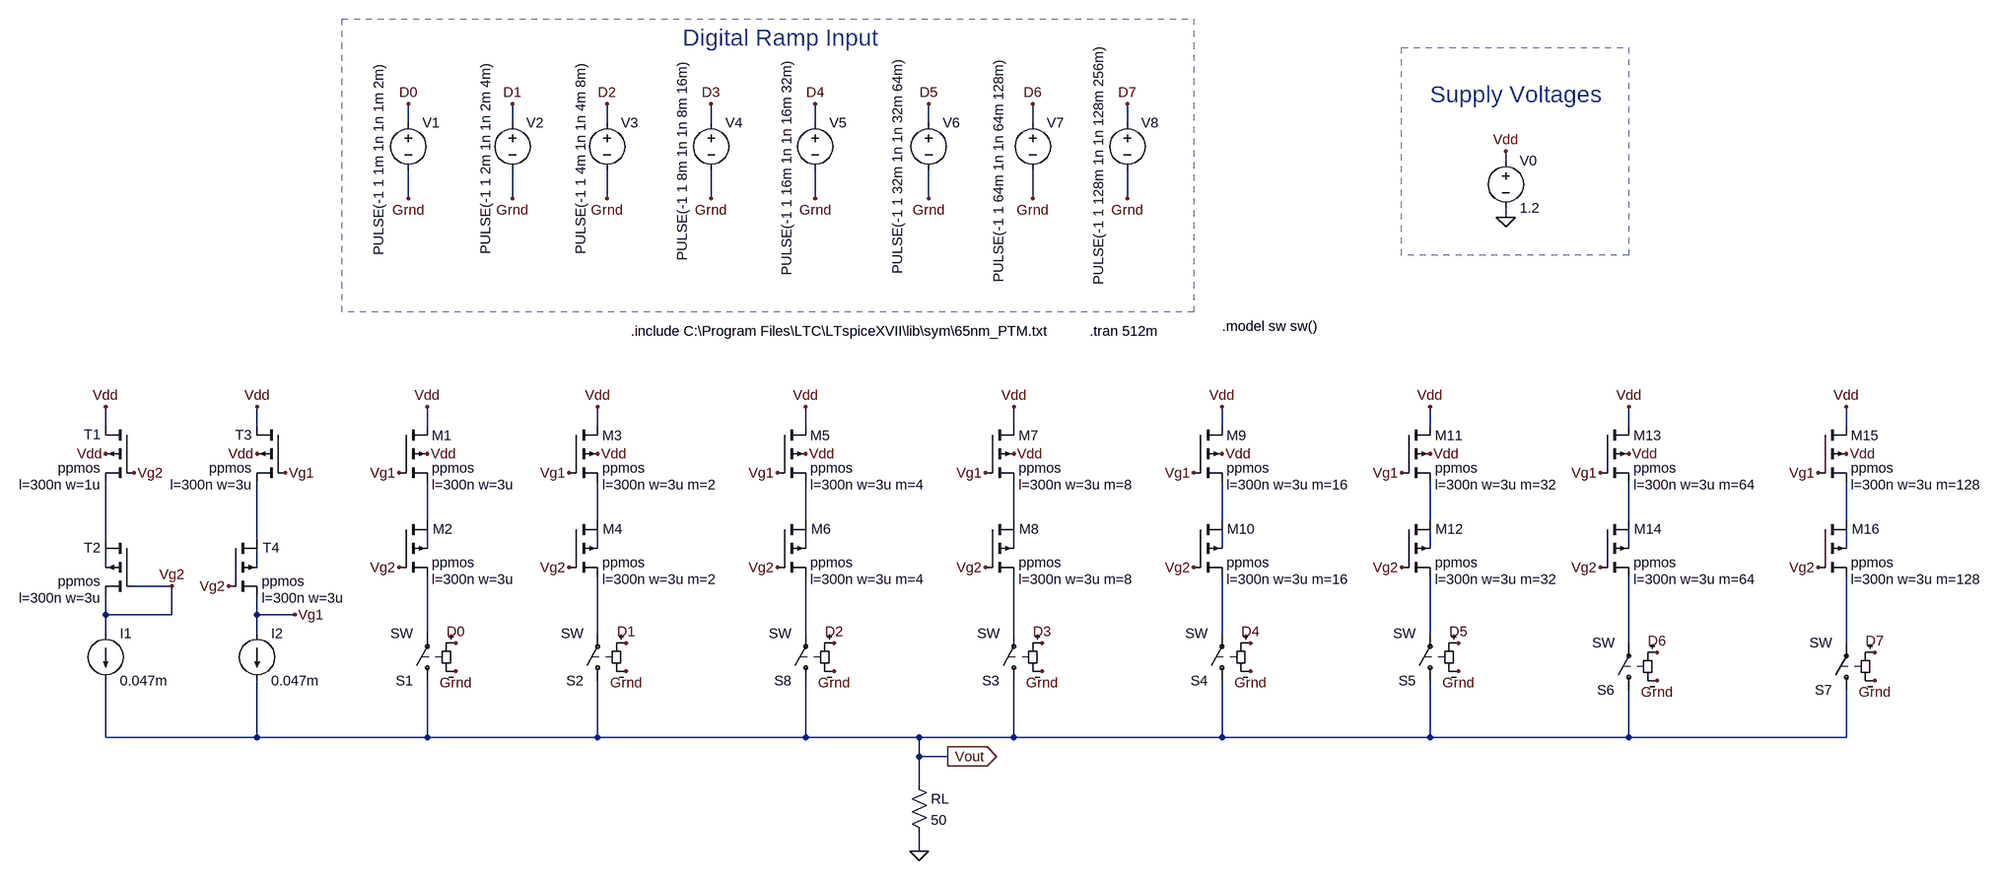
[diagram p0: schematic DAC_sooch_cascode_current_mirror.asc]
DAC_sooch_cascode_current_mirror.asc, the LTspice schematic file:
Version 4
SHEET 1 3044 1416
WIRE 240 -416 240 -448
WIRE 416 -416 416 -448
WIRE 576 -416 576 -448
WIRE 752 -416 752 -448
WIRE 928 -416 928 -448
WIRE 1120 -416 1120 -448
WIRE 1296 -416 1296 -448
WIRE 1456 -416 1456 -448
WIRE 2096 -352 2096 -368
WIRE 240 -288 240 -336
WIRE 416 -288 416 -336
WIRE 576 -288 576 -336
WIRE 752 -288 752 -336
WIRE 928 -288 928 -336
WIRE 1120 -288 1120 -336
WIRE 1296 -288 1296 -336
WIRE 1456 -288 1456 -336
WIRE 2096 -256 2096 -272
WIRE -272 96 -272 64
WIRE -16 96 -16 64
WIRE 272 96 272 64
WIRE 560 96 560 64
WIRE 912 96 912 64
WIRE 1264 96 1264 64
WIRE 1616 96 1616 64
WIRE 1968 96 1968 64
WIRE 2304 96 2304 64
WIRE 2672 96 2672 64
WIRE 272 256 272 192
WIRE 560 256 560 192
WIRE 912 256 912 192
WIRE 1264 256 1264 192
WIRE 1616 256 1616 192
WIRE 1968 256 1968 192
WIRE 2304 256 2304 192
WIRE 2672 256 2672 192
WIRE -272 288 -272 192
WIRE -16 288 -16 192
WIRE 272 304 272 272
WIRE 560 304 560 272
WIRE 912 304 912 272
WIRE 1264 304 1264 272
WIRE 1616 304 1616 272
WIRE 1968 304 1968 272
WIRE 2304 304 2304 272
WIRE 2672 304 2672 272
WIRE -272 336 -272 304
WIRE -16 336 -16 304
WIRE -160 368 -224 368
WIRE -272 416 -272 384
WIRE -160 416 -160 368
WIRE -160 416 -272 416
WIRE -16 416 -16 384
WIRE 48 416 -16 416
WIRE -272 448 -272 416
WIRE -16 448 -16 416
WIRE 272 448 272 352
WIRE 560 448 560 352
WIRE 912 448 912 352
WIRE 1264 448 1264 352
WIRE 1616 448 1616 352
WIRE 1968 448 1968 352
WIRE 2304 464 2304 352
WIRE 2672 464 2672 352
WIRE -272 624 -272 528
WIRE -16 624 -16 528
WIRE -16 624 -272 624
WIRE 272 624 272 528
WIRE 272 624 -16 624
WIRE 560 624 560 528
WIRE 560 624 272 624
WIRE 912 624 912 528
WIRE 912 624 560 624
WIRE 1104 624 912 624
WIRE 1264 624 1264 528
WIRE 1264 624 1104 624
WIRE 1616 624 1616 528
WIRE 1616 624 1264 624
WIRE 1968 624 1968 528
WIRE 1968 624 1616 624
WIRE 2304 624 2304 544
WIRE 2304 624 1968 624
WIRE 2672 624 2672 544
WIRE 2672 624 2304 624
WIRE 1104 656 1104 624
WIRE 1152 656 1104 656
WIRE 1104 704 1104 656
WIRE 1104 816 1104 784
FLAG -272 144 Vdd
FLAG -16 144 Vdd
FLAG -16 64 Vdd
FLAG -272 64 Vdd
FLAG -224 176 Vg2
FLAG -160 368 Vg2
FLAG 32 176 Vg1
FLAG 48 416 Vg1
FLAG 272 144 Vdd
FLAG 272 64 Vdd
FLAG 224 176 Vg1
FLAG 224 336 Vg2
FLAG -64 368 Vg2
FLAG 560 144 Vdd
FLAG 560 64 Vdd
FLAG 512 176 Vg1
FLAG 512 336 Vg2
FLAG 912 144 Vdd
FLAG 912 64 Vdd
FLAG 864 176 Vg1
FLAG 864 336 Vg2
FLAG 1264 144 Vdd
FLAG 1264 64 Vdd
FLAG 1216 176 Vg1
FLAG 1216 336 Vg2
FLAG 1616 144 Vdd
FLAG 1616 64 Vdd
FLAG 1568 176 Vg1
FLAG 1568 336 Vg2
FLAG 1968 144 Vdd
FLAG 1968 64 Vdd
FLAG 1920 176 Vg1
FLAG 1920 336 Vg2
FLAG 2304 144 Vdd
FLAG 2304 64 Vdd
FLAG 2256 176 Vg1
FLAG 2256 336 Vg2
FLAG 2672 144 Vdd
FLAG 2672 64 Vdd
FLAG 2624 176 Vg1
FLAG 2624 336 Vg2
FLAG 2096 -368 Vdd
FLAG 416 -288 Grnd
FLAG 576 -288 Grnd
FLAG 752 -288 Grnd
FLAG 928 -288 Grnd
FLAG 1120 -288 Grnd
FLAG 1296 -288 Grnd
FLAG 1456 -288 Grnd
FLAG 240 -288 Grnd
FLAG 240 -448 D0
FLAG 416 -448 D1
FLAG 576 -448 D2
FLAG 752 -448 D3
FLAG 928 -448 D4
FLAG 1120 -448 D5
FLAG 1296 -448 D6
FLAG 1456 -448 D7
FLAG 320 512 Grnd
FLAG 608 512 Grnd
FLAG 960 512 Grnd
FLAG 1312 512 Grnd
FLAG 1664 512 Grnd
FLAG 2016 512 Grnd
FLAG 2352 528 Grnd
FLAG 2720 528 Grnd
FLAG 320 464 D0
FLAG 608 464 D1
FLAG 960 464 D2
FLAG 1312 464 D3
FLAG 1664 464 D4
FLAG 2016 464 D5
FLAG 2352 480 D6
FLAG 2720 480 D7
FLAG 1104 816 0
FLAG 1152 656 Vout
IOPIN 1152 656 Out
FLAG 2096 -256 0
SYMBOL pmos4 32 96 M0
WINDOW 0 56 16 Left 2
WINDOW 123 56 100 Left 2
SYMATTR InstName T3
SYMATTR Value2 l=300n w=3u
SYMATTR Value ppmos
SYMBOL pmos4 -64 288 R0
WINDOW 0 58 15 Left 2
WINDOW 123 56 100 Left 2
SYMATTR InstName T4
SYMATTR Value2 l=300n w=3u
SYMATTR Value ppmos
SYMBOL pmos4 -224 288 M0
WINDOW 0 56 15 Left 2
WINDOW 123 56 100 Left 2
SYMATTR InstName T2
SYMATTR Value2 l=300n w=3u
SYMATTR Value ppmos
SYMBOL current -272 448 R0
WINDOW 123 0 0 Left 0
WINDOW 39 0 0 Left 0
SYMATTR InstName I1
SYMATTR Value 0.047m
SYMBOL current -16 448 R0
WINDOW 123 0 0 Left 0
WINDOW 39 0 0 Left 0
SYMATTR InstName I2
SYMATTR Value 0.047m
SYMBOL pmos4 -224 96 M0
WINDOW 0 56 15 Left 2
WINDOW 123 56 100 Left 2
SYMATTR InstName T1
SYMATTR Value2 l=300n w=1u
SYMATTR Value ppmos
SYMBOL pmos4 224 96 R0
WINDOW 0 56 17 Left 2
WINDOW 123 56 100 Left 2
SYMATTR InstName M1
SYMATTR Value2 l=300n w=3u
SYMATTR Value ppmos
SYMBOL pmos4 224 256 R0
WINDOW 0 57 15 Left 2
WINDOW 123 56 100 Left 2
SYMATTR InstName M2
SYMATTR Value2 l=300n w=3u
SYMATTR Value ppmos
SYMBOL pmos4 512 96 R0
WINDOW 0 56 17 Left 2
WINDOW 123 56 100 Left 2
SYMATTR InstName M3
SYMATTR Value2 l=300n w=3u m=2
SYMATTR Value ppmos
SYMBOL pmos4 512 256 R0
WINDOW 0 57 15 Left 2
WINDOW 123 56 100 Left 2
SYMATTR InstName M4
SYMATTR Value2 l=300n w=3u m=2
SYMATTR Value ppmos
SYMBOL pmos4 864 96 R0
WINDOW 0 56 17 Left 2
WINDOW 123 56 100 Left 2
SYMATTR InstName M5
SYMATTR Value2 l=300n w=3u m=4
SYMATTR Value ppmos
SYMBOL pmos4 864 256 R0
WINDOW 0 57 15 Left 2
WINDOW 123 56 100 Left 2
SYMATTR InstName M6
SYMATTR Value2 l=300n w=3u m=4
SYMATTR Value ppmos
SYMBOL pmos4 1216 96 R0
WINDOW 0 56 17 Left 2
WINDOW 123 56 100 Left 2
SYMATTR InstName M7
SYMATTR Value2 l=300n w=3u m=8
SYMATTR Value ppmos
SYMBOL pmos4 1216 256 R0
WINDOW 0 57 15 Left 2
WINDOW 123 56 100 Left 2
SYMATTR InstName M8
SYMATTR Value2 l=300n w=3u m=8
SYMATTR Value ppmos
SYMBOL pmos4 1568 96 R0
WINDOW 0 56 17 Left 2
WINDOW 123 56 100 Left 2
SYMATTR InstName M9
SYMATTR Value2 l=300n w=3u m=16
SYMATTR Value ppmos
SYMBOL pmos4 1568 256 R0
WINDOW 0 57 15 Left 2
WINDOW 123 56 100 Left 2
SYMATTR InstName M10
SYMATTR Value2 l=300n w=3u m=16
SYMATTR Value ppmos
SYMBOL pmos4 1920 96 R0
WINDOW 0 56 17 Left 2
WINDOW 123 56 100 Left 2
SYMATTR InstName M11
SYMATTR Value2 l=300n w=3u m=32
SYMATTR Value ppmos
SYMBOL pmos4 1920 256 R0
WINDOW 0 57 15 Left 2
WINDOW 123 56 100 Left 2
SYMATTR InstName M12
SYMATTR Value2 l=300n w=3u m=32
SYMATTR Value ppmos
SYMBOL pmos4 2256 96 R0
WINDOW 0 56 17 Left 2
WINDOW 123 56 100 Left 2
SYMATTR InstName M13
SYMATTR Value2 l=300n w=3u m=64
SYMATTR Value ppmos
SYMBOL pmos4 2256 256 R0
WINDOW 0 57 15 Left 2
WINDOW 123 56 100 Left 2
SYMATTR InstName M14
SYMATTR Value2 l=300n w=3u m=64
SYMATTR Value ppmos
SYMBOL pmos4 2624 96 R0
WINDOW 0 56 17 Left 2
WINDOW 123 56 100 Left 2
SYMATTR InstName M15
SYMATTR Value2 l=300n w=3u m=128
SYMATTR Value ppmos
SYMBOL pmos4 2624 256 R0
WINDOW 0 57 15 Left 2
WINDOW 123 56 100 Left 2
SYMATTR InstName M16
SYMATTR Value2 l=300n w=3u m=128
SYMATTR Value ppmos
SYMBOL voltage 2096 -368 R0
WINDOW 123 0 0 Left 0
WINDOW 39 0 0 Left 0
SYMATTR InstName V0
SYMATTR Value 1.2
SYMBOL voltage 240 -432 R0
WINDOW 3 -50 -85 VRight 2
WINDOW 123 0 0 Left 0
WINDOW 39 0 0 Left 0
SYMATTR Value PULSE(-1 1 1m 1n 1n 1m 2m)
SYMATTR InstName V1
SYMBOL voltage 416 -432 R0
WINDOW 3 -45 -87 VRight 2
WINDOW 123 0 0 Left 0
WINDOW 39 0 0 Left 0
SYMATTR Value PULSE(-1 1 2m 1n 1n 2m 4m)
SYMATTR InstName V2
SYMBOL voltage 576 -432 R0
WINDOW 3 -44 -87 VRight 2
WINDOW 123 0 0 Left 0
WINDOW 39 0 0 Left 0
SYMATTR Value PULSE(-1 1 4m 1n 1n 4m 8m)
SYMATTR InstName V3
SYMBOL voltage 752 -432 R0
WINDOW 3 -48 -89 VRight 2
WINDOW 123 0 0 Left 0
WINDOW 39 0 0 Left 0
SYMATTR Value PULSE(-1 1 8m 1n 1n 8m 16m)
SYMATTR InstName V4
SYMBOL voltage 928 -432 R0
WINDOW 3 -48 -92 VRight 2
WINDOW 123 0 0 Left 0
WINDOW 39 0 0 Left 0
SYMATTR Value PULSE(-1 1 16m 1n 1n 16m 32m)
SYMATTR InstName V5
SYMBOL voltage 1120 -432 R0
WINDOW 3 -52 -94 VRight 2
WINDOW 123 0 0 Left 0
WINDOW 39 0 0 Left 0
SYMATTR Value PULSE(-1 1 32m 1n 1n 32m 64m)
SYMATTR InstName V6
SYMBOL voltage 1296 -432 R0
WINDOW 3 -57 -93 VRight 2
WINDOW 123 0 0 Left 0
WINDOW 39 0 0 Left 0
SYMATTR Value PULSE(-1 1 64m 1n 1n 64m 128m)
SYMATTR InstName V7
SYMBOL voltage 1456 -432 R0
WINDOW 3 -48 -116 VRight 2
WINDOW 123 0 0 Left 0
WINDOW 39 0 0 Left 0
SYMATTR Value PULSE(-1 1 128m 1n 1n 128m 256m)
SYMATTR InstName V8
SYMBOL sw 272 544 R180
SYMATTR InstName S1
SYMBOL sw 560 544 R180
SYMATTR InstName S2
SYMBOL sw 1264 544 R180
SYMATTR InstName S3
SYMBOL sw 1616 544 R180
SYMATTR InstName S4
SYMBOL sw 1968 544 R180
SYMATTR InstName S5
SYMBOL sw 2304 560 R180
SYMATTR InstName S6
SYMBOL sw 2672 560 R180
SYMATTR InstName S7
SYMBOL sw 912 544 R180
SYMATTR InstName S8
SYMBOL res 1088 688 R0
SYMATTR InstName RL
SYMATTR Value 50
TEXT 616 -64 Left 2 !.include C:\\Program Files\\LTC\\LTspiceXVII\\lib\\sym\\65nm_PTM.txt
TEXT 1616 -72 Left 2 !.model sw sw()
TEXT 1392 -64 Left 2 !.tran 512m
TEXT 704 -560 Left 4 ;Digital Ramp Input
TEXT 1968 -464 Left 4 ;Supply Voltages
RECTANGLE Normal 1568 -96 128 -592 2
RECTANGLE Normal 2304 -192 1920 -544 2

The netlist it stands for:
* DAC_sooch_cascode_current_mirror.asc
M§T3 Vdd Vg1 N010 Vdd ppmos l=300n w=3u
M§T4 N010 Vg2 Vg1 N020 ppmos l=300n w=3u
M§T2 N009 Vg2 Vg2 N019 ppmos l=300n w=3u
I1 Vg2 Vout 0.047m
I2 Vg1 Vout 0.047m
M§T1 Vdd Vg2 N009 Vdd ppmos l=300n w=1u
M1 Vdd Vg1 N001 Vdd ppmos l=300n w=3u
M2 N001 Vg2 N021 N011 ppmos l=300n w=3u
M3 Vdd Vg1 N002 Vdd ppmos l=300n w=3u m=2
M4 N002 Vg2 N022 N012 ppmos l=300n w=3u m=2
M5 Vdd Vg1 N003 Vdd ppmos l=300n w=3u m=4
M6 N003 Vg2 N023 N013 ppmos l=300n w=3u m=4
M7 Vdd Vg1 N004 Vdd ppmos l=300n w=3u m=8
M8 N004 Vg2 N024 N014 ppmos l=300n w=3u m=8
M9 Vdd Vg1 N005 Vdd ppmos l=300n w=3u m=16
M10 N005 Vg2 N025 N015 ppmos l=300n w=3u m=16
M11 Vdd Vg1 N006 Vdd ppmos l=300n w=3u m=32
M12 N006 Vg2 N026 N016 ppmos l=300n w=3u m=32
M13 Vdd Vg1 N007 Vdd ppmos l=300n w=3u m=64
M14 N007 Vg2 N027 N017 ppmos l=300n w=3u m=64
M15 Vdd Vg1 N008 Vdd ppmos l=300n w=3u m=128
M16 N008 Vg2 N028 N018 ppmos l=300n w=3u m=128
V0 Vdd 0 1.2
V1 D0 Grnd PULSE(-1 1 1m 1n 1n 1m 2m)
V2 D1 Grnd PULSE(-1 1 2m 1n 1n 2m 4m)
V3 D2 Grnd PULSE(-1 1 4m 1n 1n 4m 8m)
V4 D3 Grnd PULSE(-1 1 8m 1n 1n 8m 16m)
V5 D4 Grnd PULSE(-1 1 16m 1n 1n 16m 32m)
V6 D5 Grnd PULSE(-1 1 32m 1n 1n 32m 64m)
V7 D6 Grnd PULSE(-1 1 64m 1n 1n 64m 128m)
V8 D7 Grnd PULSE(-1 1 128m 1n 1n 128m 256m)
S1 Vout N021 D0 Grnd SW
S2 Vout N022 D1 Grnd SW
S3 Vout N024 D3 Grnd SW
S4 Vout N025 D4 Grnd SW
S5 Vout N026 D5 Grnd SW
S6 Vout N027 D6 Grnd SW
S7 Vout N028 D7 Grnd SW
S8 Vout N023 D2 Grnd SW
RL Vout 0 50
.model NMOS NMOS
.model PMOS PMOS
.lib standard.mos
.include C:\Program Files\LTC\LTspiceXVII\lib\sym\65nm_PTM.txt
.model sw sw()
.tran 512m
* Digital Ramp Input
* Supply Voltages
.backanno
.end